# Altium schematic sheet CANHub.SchDoc
size A3
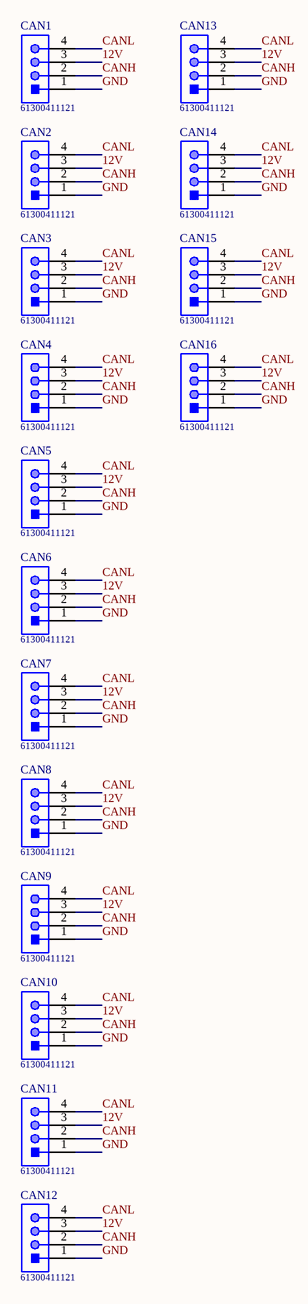
[diagram p0: CANHub.SchDoc]

## Parts
CAN1  61300411121  [61300411121]
CAN2  61300411121  [61300411121]
CAN3  61300411121  [61300411121]
CAN4  61300411121  [61300411121]
CAN5  61300411121  [61300411121]
CAN6  61300411121  [61300411121]
CAN7  61300411121  [61300411121]
CAN8  61300411121  [61300411121]
CAN9  61300411121  [61300411121]
CAN10  61300411121  [61300411121]
CAN11  61300411121  [61300411121]
CAN12  61300411121  [61300411121]
CAN13  61300411121  [61300411121]
CAN14  61300411121  [61300411121]
CAN15  61300411121  [61300411121]
CAN16  61300411121  [61300411121]

## Nets
12V: CAN1.3 CAN2.3 CAN3.3 CAN4.3 CAN5.3 CAN6.3 CAN7.3 CAN8.3 CAN9.3 CAN10.3 CAN11.3 CAN12.3 CAN13.3 CAN14.3 CAN15.3 CAN16.3
CANH: CAN1.2 CAN2.2 CAN3.2 CAN4.2 CAN5.2 CAN6.2 CAN7.2 CAN8.2 CAN9.2 CAN10.2 CAN11.2 CAN12.2 CAN13.2 CAN14.2 CAN15.2 CAN16.2
CANL: CAN1.4 CAN2.4 CAN3.4 CAN4.4 CAN5.4 CAN6.4 CAN7.4 CAN8.4 CAN9.4 CAN10.4 CAN11.4 CAN12.4 CAN13.4 CAN14.4 CAN15.4 CAN16.4
GND: CAN1.1 CAN2.1 CAN3.1 CAN4.1 CAN5.1 CAN6.1 CAN7.1 CAN8.1 CAN9.1 CAN10.1 CAN11.1 CAN12.1 CAN13.1 CAN14.1 CAN15.1 CAN16.1

## Library data of the parts
CAN1-CAN16 = CMP-1502-01064-1: THT Vertical Pin Header WR-PHD, Pitch 2.54 mm, Single Row, 4 pins; Manufacturer: Wurth Elektronik; Withstanding Voltage: 500VAC; Rated Current: 3A; Working Voltage: 250VAC; Pin Number: 4; Gender: Male; Contact Resistance: 20mOhm; Pitch: 2.54mm; Manufacturer URL: http://www.we-online.de; Operating Temperature: -40to105degC; Packaging: Bag; Mounting Technology: THT; Package Reference: 61300411121; Datasheet URL: https://katalog.we-online.de/em/datasheet/6130xx11121.pdf; Publisher: WurthElektronik; Part Number: 61300411121; Row Number: Single; Orientation: Vertical